# EAGLE design OpenCoffee V2 (DBL Test) (EAGLE 9.5.0)
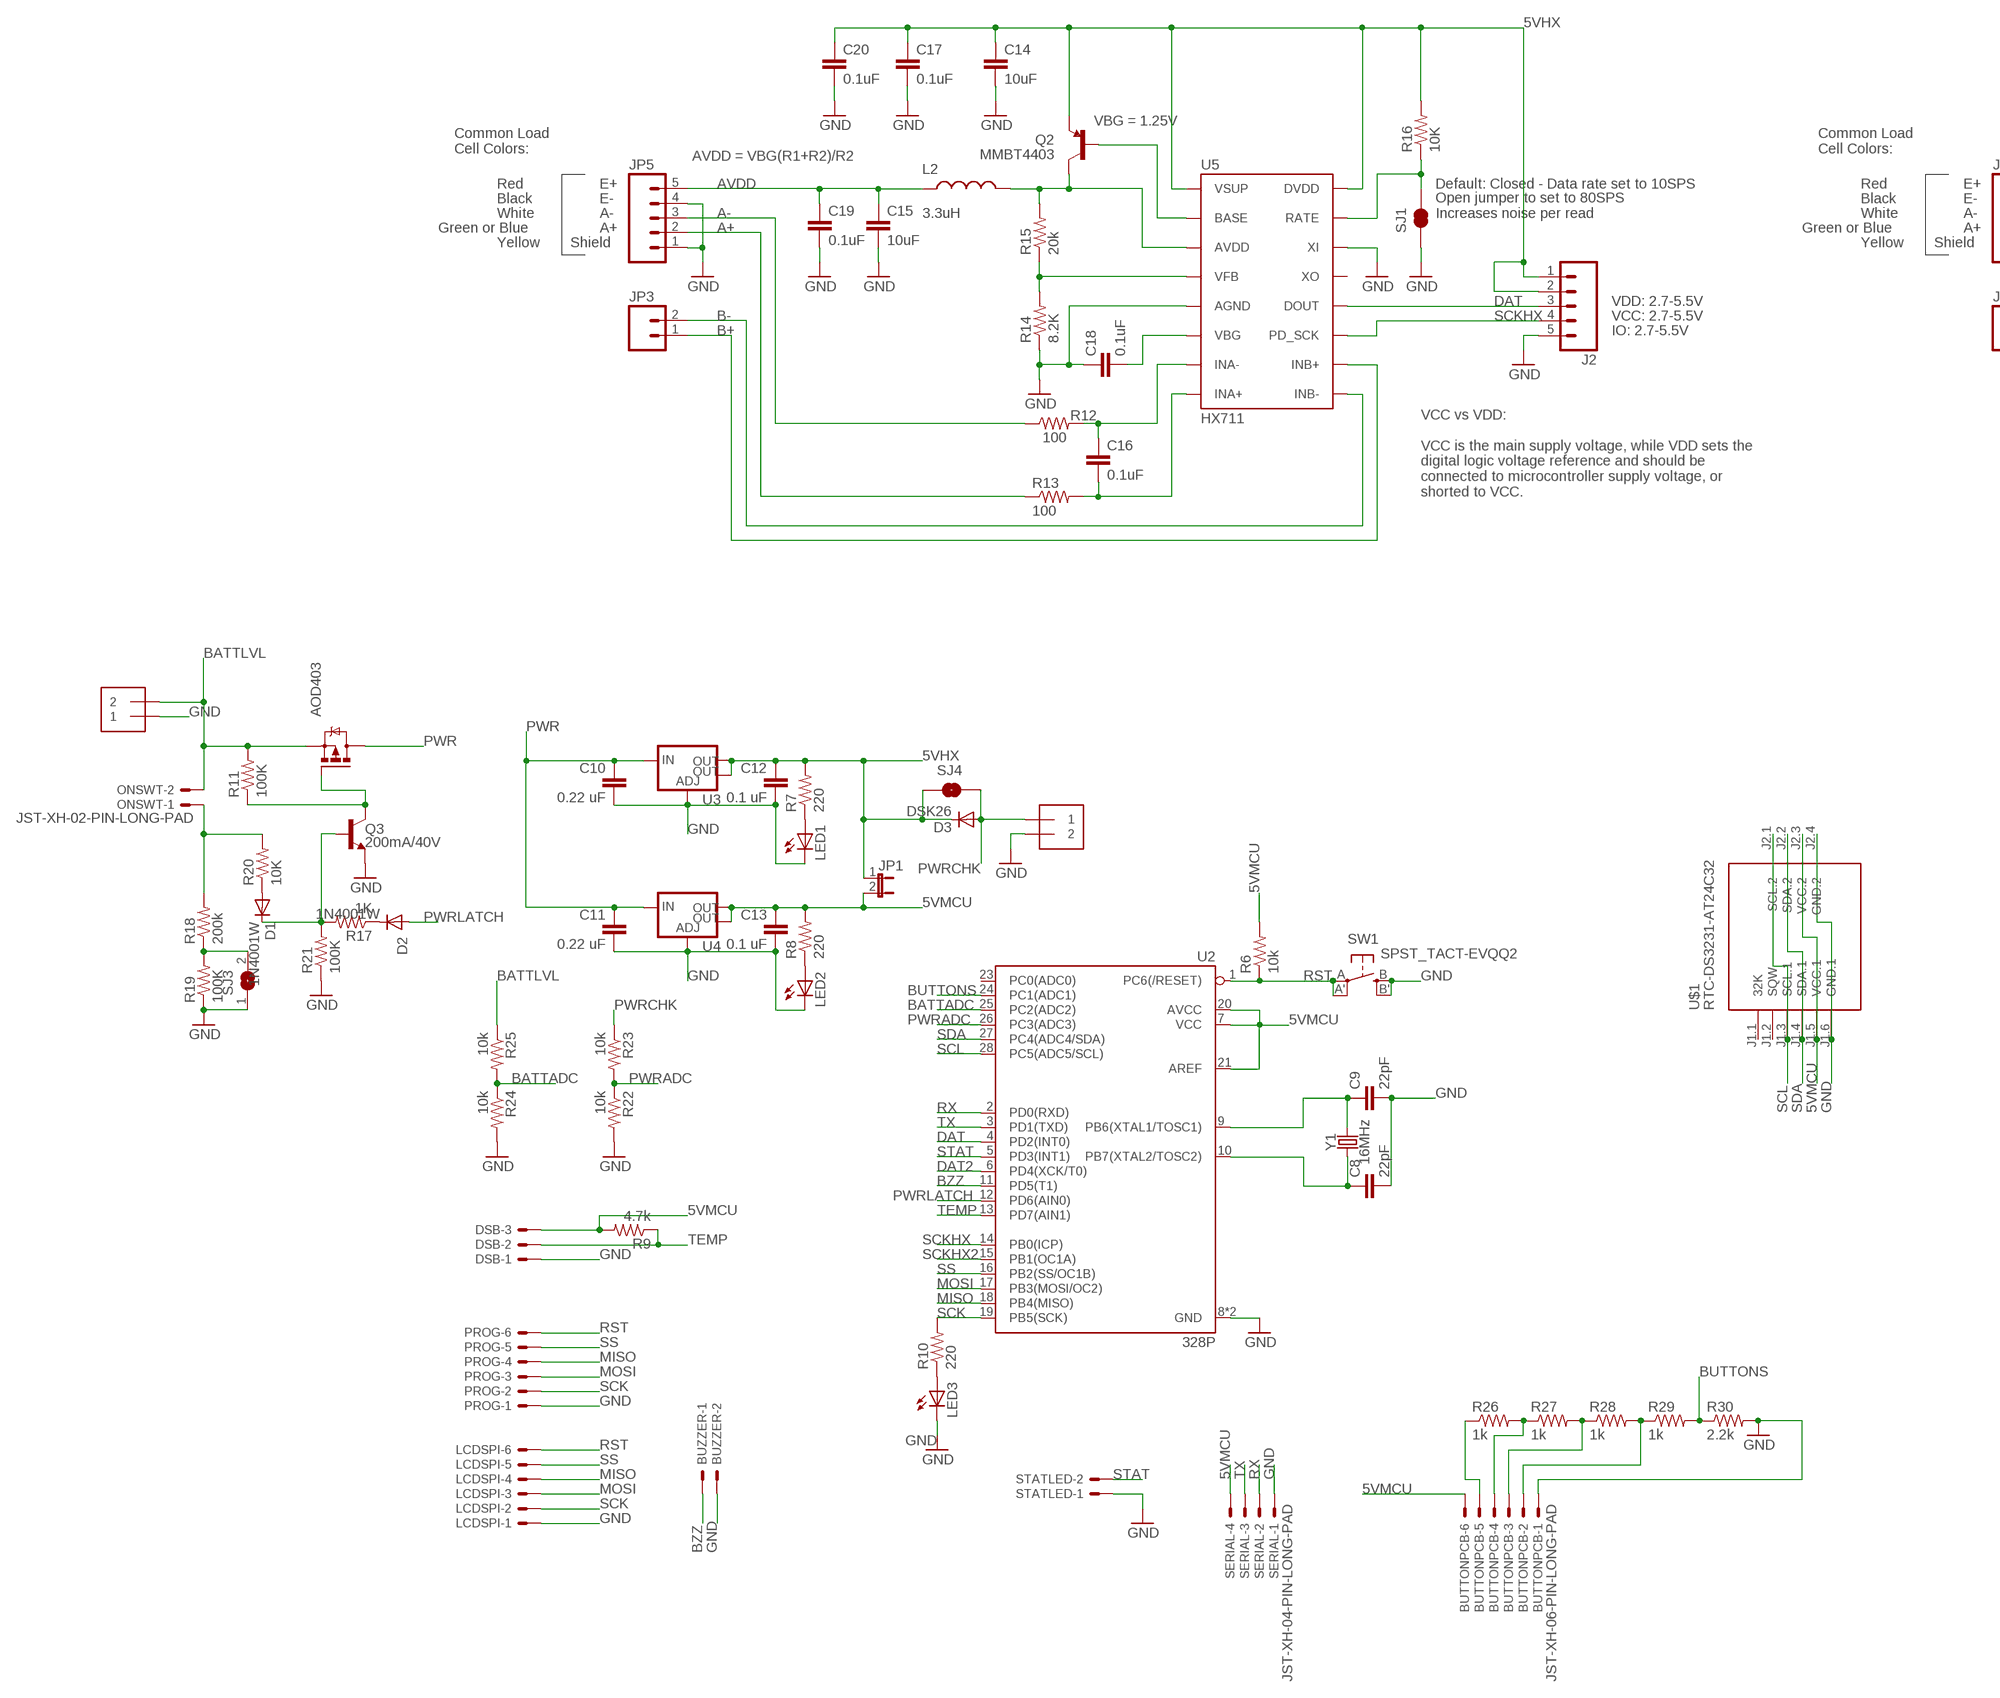
[diagram p0: schematic, sheet 1, part 1 of 2]
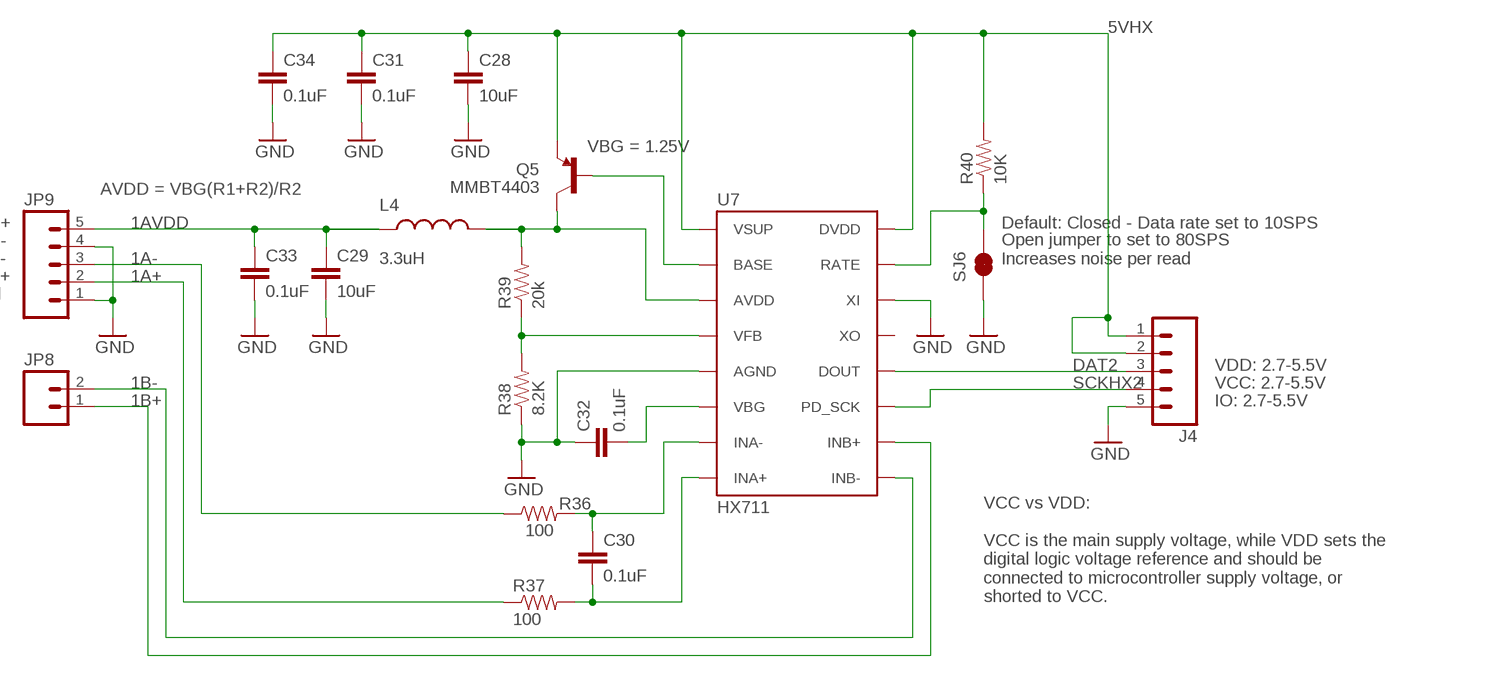
[diagram p1: schematic, sheet 1, part 2 of 2]

## Parts
AOD403  IRFR5305  [D-PAK_TO252AA]
BATT  1X2-3.5MM  [1X2-3.5MM]
BUTTONPCB  JST-XH-06-PIN-LONG-PAD  [JST-XH-06-PACKAGE-LONG-PAD]
BUZZER  JST-XH-02-PIN-LONG-PAD  [JST-XH-02-PACKAGE-LONG-PAD]
C8  22pF  C-EUC1206  [C1206]
C9  22pF  C-EUC1206  [C1206]
C10  0.22 uF  C-EUC1206  [C1206]
C11  0.22 uF  C-EUC1206  [C1206]
C12  0.1 uF  C-EUC1206  [C1206]
C13  0.1 uF  C-EUC1206  [C1206]
C14  10uF  10UF50V20%(1210)  [1210]
C15  10uF  10UF50V20%(1210)  [1210]
C16  0.1uF  0.1UF-25V-5%(0603)  [0603-CAP]
C17  0.1uF  0.1UF-25V-5%(0603)  [0603-CAP]
C18  0.1uF  0.1UF-25V-5%(0603)  [0603-CAP]
C19  0.1uF  0.1UF-25V-5%(0603)  [0603-CAP]
C20  0.1uF  0.1UF-25V-5%(0603)  [0603-CAP]
C28  10uF  10UF50V20%(1210)  [1210]
C29  10uF  10UF50V20%(1210)  [1210]
C30  0.1uF  0.1UF-25V-5%(0603)  [0603-CAP]
C31  0.1uF  0.1UF-25V-5%(0603)  [0603-CAP]
C32  0.1uF  0.1UF-25V-5%(0603)  [0603-CAP]
C33  0.1uF  0.1UF-25V-5%(0603)  [0603-CAP]
C34  0.1uF  0.1UF-25V-5%(0603)  [0603-CAP]
D1  1N4001W  DIODE-SOD123  [SOD123]
D2  1N4001W  DIODE-SOD123  [SOD123]
D3  DSK26  DIODE-SOD123  [SOD123]
DSB  JST-XH-03-PIN-LONG-PAD  [JST-XH-03-PACKAGE-LONG-PAD]
J2  M05PTH  [1X05]
J4  M05PTH  [1X05]
JP1  JP1E  [JP1]
JP3  M02PTH  [1X02]
JP5  M05PTH  [1X05]
JP8  M02PTH  [1X02]
JP9  M05PTH  [1X05]
L2  3.3uH  INDUCTOR0805-IND  [0805]
L4  3.3uH  INDUCTOR0805-IND  [0805]
LCDSPI  JST-XH-06-PIN-LONG-PAD  [JST-XH-06-PACKAGE-LONG-PAD]
LED1  LEDCHIPLED_1206  [CHIPLED_1206]
LED2  LEDCHIPLED_1206  [CHIPLED_1206]
LED3  LEDCHIPLED_1206  [CHIPLED_1206]
ONSWT  JST-XH-02-PIN-LONG-PAD  [JST-XH-02-PACKAGE-LONG-PAD]
PROG  JST-XH-06-PIN-LONG-PAD  [JST-XH-06-PACKAGE-LONG-PAD]
Q2  MMBT4403  TRANSISTOR_PNPMMBT4403  [SOT23-3]
Q3  200mA/40V  TRANS_NPN-2N3904  [TO-92@1]
Q5  MMBT4403  TRANSISTOR_PNPMMBT4403  [SOT23-3]
R6  10k  R-US_R1206  [R1206]
R7  220  R-US_R1206  [R1206]
R8  220  R-US_R1206  [R1206]
R9  4.7k  R-US_R1206  [R1206]
R10  220  R-US_R1206  [R1206]
R11  100K  R-US_R1206  [R1206]
R12  100  100OHM-1/10W-1%(0603)  [0603-RES]
R13  100  100OHM-1/10W-1%(0603)  [0603-RES]
R14  8.2K  8.2KOHM-1/10W-5%(0603)  [0603-RES]
R15  20k  20KOHM1/10W1%(0603)  [0603-RES]
R16  10K  10KOHM-1/10W-1%(0603)0603  [0603-RES]
R17  1K  R-US_R1206  [R1206]
R18  200k  R-US_R1206  [R1206]
R19  100K  R-US_R1206  [R1206]
R20  10K  R-US_R1206  [R1206]
R21  100K  R-US_R1206  [R1206]
R22  10k  R-US_R1206  [R1206]
R23  10k  R-US_R1206  [R1206]
R24  10k  R-US_R1206  [R1206]
R25  10k  R-US_R1206  [R1206]
R26  1k  R-US_R1206  [R1206]
R27  1k  R-US_R1206  [R1206]
R28  1k  R-US_R1206  [R1206]
R29  1k  R-US_R1206  [R1206]
R30  2.2k  R-US_R1206  [R1206]
R36  100  100OHM-1/10W-1%(0603)  [0603-RES]
R37  100  100OHM-1/10W-1%(0603)  [0603-RES]
R38  8.2K  8.2KOHM-1/10W-5%(0603)  [0603-RES]
R39  20k  20KOHM1/10W1%(0603)  [0603-RES]
R40  10K  10KOHM-1/10W-1%(0603)0603  [0603-RES]
SERIAL  JST-XH-04-PIN-LONG-PAD  [JST-XH-04-PACKAGE-LONG-PAD]
SJ1  JUMPER-PAD-2-NC_BY_TRACE  [PAD-JUMPER-2-NC_BY_TRACE_YES_SILK]
SJ3  SJ  [SJ]
SJ4  SOLDERJUMPERNO  [SJ_2S-NO]
SJ6  JUMPER-PAD-2-NC_BY_TRACE  [PAD-JUMPER-2-NC_BY_TRACE_YES_SILK]
STATLED  JST-XH-02-PIN-LONG-PAD  [JST-XH-02-PACKAGE-LONG-PAD]
SW1  SPST_TACT-EVQQ2  [EVQ-Q2]
U2  328P  ATMEGA328P_PDIP  [DIP28]
U3  V_REG_LM1117SOT223  [SOT223]
U4  V_REG_LM1117SOT223  [SOT223]
U5  HX711  HX711HX711  [SO16]
U7  HX711  HX711HX711  [SO16]
U$1  RTC-DS3231-AT24C32  [RTC-DS3231-AT24C32]
USBPWR  1X2-3.5MM  [1X2-3.5MM]
Y1  16MHz  CRYSTAL-16MHZPTH-HC49US  [HC49US]

## Nets
1A+: JP9.2 R37.1
1A-: JP9.3 R36.1
1AVDD: C29.1 C33.1 JP9.5 L4.1
1B+: JP8.1 U7.10(INB+)
1B-: JP8.2 U7.9(INB-)
5VHX: C12.1 C14.1 C17.1 C20.1 C28.1 C31.1 C34.1 D3.C J2.1 J2.2 J4.1 J4.2 JP1.1 Q2.2(E) Q5.2(E) R7.2 R16.2 R40.2 SJ4.1 U3.2(OUT) U3.4(OUT) U5.1(VSUP) U5.16(DVDD) U7.1(VSUP) U7.16(DVDD)
5VMCU: BUTTONPCB.6 C13.1 DSB.3 JP1.2 R6.2 R8.2 R9.2 SERIAL.4 U2.7(VCC) U2.20(AVCC) U2.21(AREF) U4.2(OUT) U4.4(OUT) U$1.J1.5(VCC.1) U$1.J2.3(VCC.2)
A+: JP5.2 R13.1
A-: JP5.3 R12.1
AVDD: C15.1 C19.1 JP5.5 L2.1
B+: JP3.1 U5.10(INB+)
B-: JP3.2 U5.9(INB-)
BATTADC: R24.1 R25.2 U2.25(PC2(ADC2))
BATTLVL: AOD403.3(S) BATT.2 ONSWT.2 R11.2 R25.1
BUTTONS: R29.2 R30.1 U2.24(PC1(ADC1))
BZZ: BUZZER.1 U2.11(PD5(T1))
DAT: J2.3 U2.4(PD2(INT0)) U5.12(DOUT)
DAT2: J4.3 U2.6(PD4(XCK/T0)) U7.12(DOUT)
GND: BATT.1 BUTTONPCB.1 BUZZER.2 C8.2 C9.2 C10.2 C11.2 C12.2 C13.2 C14.2 C15.2 C17.2 C18.1 C19.2 C20.2 C28.2 C29.2 C31.2 C32.1 C33.2 C34.2 DSB.1 J2.5 J4.5 JP5.1 JP5.4 JP9.1 JP9.4 LCDSPI.1 LED1.C LED2.C LED3.C PROG.1 Q3.1(E) R14.1 R19.1 R21.1 R22.2 R24.2 R30.2 R38.1 SERIAL.1 SJ1.1 SJ3.1 SJ6.1 STATLED.1 SW1.B'(S1) SW1.B(S) U2.8(GND) U2.22(GND) U3.1(ADJ) U4.1(ADJ) U5.5(AGND) U5.14(XI) U7.5(AGND) U7.14(XI) U$1.J1.6(GND.1) U$1.J2.4(GND.2) USBPWR.2
MISO: LCDSPI.4 PROG.4 U2.18(PB4(MISO))
MOSI: LCDSPI.3 PROG.3 U2.17(PB3(MOSI/OC2))
N$8: C9.1 U2.9(PB6(XTAL1/TOSC1)) Y1.2
N$9: C8.1 U2.10(PB7(XTAL2/TOSC2)) Y1.1
N$11: AOD403.1(G) Q3.3(C) R11.1
N$16: Q2.1(B) U5.2(BASE)
N$17: D2.C R17.1
N$18: LED1.A R7.1
N$19: LED2.A R8.1
N$20: R14.2 R15.1 U5.4(VFB)
N$21: LED3.A R10.1
N$23: C18.2 U5.6(VBG)
N$25: L2.2 Q2.3(C) R15.2 U5.3(AVDD)
N$26: R16.1 SJ1.2 U5.15(RATE)
N$27: C16.1 R12.2 U5.7(INA-)
N$28: C16.2 R13.2 U5.8(INA+)
N$29: R18.1 R19.2 SJ3.2
N$30: D1.A R20.1
N$31: D1.C Q3.2(B) R17.2 R21.2
N$33: BUTTONPCB.4 R26.2 R27.1
N$34: BUTTONPCB.3 R27.2 R28.1
N$35: BUTTONPCB.2 R28.2 R29.1
N$36: BUTTONPCB.5 R26.1
N$114: Q5.1(B) U7.2(BASE)
N$115: R38.2 R39.1 U7.4(VFB)
N$116: C32.2 U7.6(VBG)
N$117: L4.2 Q5.3(C) R39.2 U7.3(AVDD)
N$118: R40.1 SJ6.2 U7.15(RATE)
N$119: C30.1 R36.2 U7.7(INA-)
N$120: C30.2 R37.2 U7.8(INA+)
ONSWT: ONSWT.1 R18.2 R20.2
PWR: AOD403.4(D) C10.1 C11.1 U3.3(IN) U4.3(IN)
PWRADC: R22.1 R23.2 U2.26(PC3(ADC3))
PWRCHK: D3.A R23.1 SJ4.2 USBPWR.1
PWRLATCH: D2.A U2.12(PD6(AIN0))
RST: LCDSPI.6 PROG.6 R6.1 SW1.A'(P1) SW1.A(P) U2.1(PC6(/RESET))
RX: SERIAL.2 U2.2(PD0(RXD))
SCK: LCDSPI.2 PROG.2 R10.2 U2.19(PB5(SCK))
SCKHX: J2.4 U2.14(PB0(ICP)) U5.11(PD_SCK)
SCKHX2: J4.4 U2.15(PB1(OC1A)) U7.11(PD_SCK)
SCL: U2.28(PC5(ADC5/SCL)) U$1.J1.3(SCL.1) U$1.J2.1(SCL.2)
SDA: U2.27(PC4(ADC4/SDA)) U$1.J1.4(SDA.1) U$1.J2.2(SDA.2)
SS: LCDSPI.5 PROG.5 U2.16(PB2(SS/OC1B))
STAT: STATLED.2 U2.5(PD3(INT1))
TEMP: DSB.2 R9.1 U2.13(PD7(AIN1))
TX: SERIAL.3 U2.3(PD1(TXD))
Unconnected: U2.23(PC0(ADC0)) U5.13(XO) U7.13(XO) U$1.J1.1(32K) U$1.J1.2(SQW)

## Notes on the sheet
- VBG = 1.25V | VBG = 1.25V
- Common Load
  Cell Colors:
- Common Load
  Cell Colors:
- AVDD = VBG(R1+R2)/R2 | AVDD = VBG(R1+R2)/R2
- Red | E+ | Default: Closed - Data rate set to 10SPS | Red | E+ | Default: Closed - Data rate set to 10SPS
- Black | E- | Black | E-
- White | A-
- Open jumper to set to 80SPS
  Increases noise per read
- White | A-
- Open jumper to set to 80SPS
  Increases noise per read
- Green or Blue | A+ | Green or Blue | A+
- Yellow | Shield | Yellow | Shield
- VDD: 2.7-5.5V | VDD: 2.7-5.5V
- VCC: 2.7-5.5V | VCC: 2.7-5.5V
- IO: 2.7-5.5V | IO: 2.7-5.5V
- VCC vs VDD:
  
  VCC is the main supply voltage, while VDD sets the
  digital logic voltage reference and should be
  connected to microcontroller supply voltage, or
  shorted to VCC.
- VCC vs VDD:
  
  VCC is the main supply voltage, while VDD sets the
  digital logic voltage reference and should be
  connected to microcontroller supply voltage, or
  shorted to VCC.

## Library data of the parts
AOD403 = transistor-power:IRF?5305: HEXFET Power MOSFET Source: http://www.irf.com/product-info/datasheets/data/irfr5305pbf.pdf
BATT USBPWR = adafruit:1X2: 3.5mm Terminal block http://www.ladyada.net/library/pcb/eaglelibrary.html
BUTTONPCB LCDSPI PROG = Rembrandt Electronics - JST XH Connectors v1-0:JST-XH-06-PIN: JST XH Connector 2 Pin Wire to board connector. Pitch: 2,54 mm, (0.100") Number of pins: 6 Created by Rembrandt Electronics www.rembrandtelectronics.com
BUZZER ONSWT STATLED = Rembrandt Electronics - JST XH Connectors v1-0:JST-XH-02-PIN: JST XH Connector 2 Pin Wire to board connector. Pitch: 2,54 mm, (0.100") Number of pins: 2 Created by Rembrandt Electronics www.rembrandtelectronics.com
C8-C13 = custom:C-EU: CAPACITOR, European symbol; SPICEPREFIX: C
C14 C15 C28 C29 = SparkFun-Capacitors:10UF50V20%(1210): CAP-09824; PROD_ID: CAP-09824
C16-C20 C30-C34 = SparkFun-Capacitors:0.1UF-25V-5%(0603): CAP-08604; PROD_ID: CAP-08604
D1-D3 = diode:DIODE-: DIODE
DSB = Rembrandt Electronics - JST XH Connectors v1-0:JST-XH-03-PIN: JST XH Connector 2 Pin Wire to board connector. Pitch: 2,54 mm, (0.100") Number of pins: 3 Created by Rembrandt Electronics www.rembrandtelectronics.com
J2 J4 JP5 JP9 = SparkFun-Connectors:M05: Header 5 Standard 5-pin 0.1" header. Use with straight break away headers (SKU : PRT-00116), right angle break away headers (PRT-00553), swiss pins (PRT-00743), machine pins (PRT-00117), and female headers (PRT-00115). Molex polarized connector foot print use with SKU : PRT-08230 with associated crimp pins and housings.
JP1 = jumper:JP1E: JUMPER
JP3 JP8 = SparkFun-Connectors:M02: Standard 2-pin 0.1" header. Use with - straight break away headers ( PRT-00116) - right angle break away headers (PRT-00553) - swiss pins (PRT-00743) - machine pins (PRT-00117) - female headers (PRT-00115) Molex polarized connector foot print use with: PRT-08233 with associated crimp pins and housings. 2.54_SCREWTERM for use with PRT-10571. 3.5mm Screw Terminal footprints for PRT-08084 5mm Screw Terminal footprints for use with PRT-08432
L2 L4 = SparkFun-Passives:INDUCTOR: Inductors Basic Inductor/Choke - 0603 and 1206. Footprints are not proven and vary greatly between part numbers. INDUCTOR POWER 3.3UH 4.0A SMD 0.197" L x 0.197" W x 0.177" H (5.00mm x 5.00mm x 4.50mm); PROD_ID: NDUC-13076
LED1-LED3 = adafruit:LED: LED OSRAM: - CHIPLED LG R971, LG N971, LY N971, LG Q971, LY Q971, LO R971, LY R971 LH N974, LH R974 LS Q976, LO Q976, LY Q976 LO Q996 - Hyper CHIPLED LW Q18S LB Q993, LB Q99A, LB R99A - SideLED LS A670, LO A670, LY A670, LG A670, LP A670 LB A673, LV A673, LT A673, LW A673 LH A674 LY A675 LS A676, LA A676, LO A676, LY A676, LW A676 LS A679, LY A679, LG A679 - Hyper Micro SIDELED® LS Y876, LA Y876, LO Y876, LY Y876 LT Y87S - SmartLED LW L88C, LW L88S LB L89C, LB L89S, LG L890 LS L89K, LO L89K, LY L89K LS L896, LA L896, LO L896, LY L896 - TOPLED LS T670, LO T670, LY T670, LG T670, LP T670 LSG T670, LSP T670, LSY T670, LOP T670, LYG T670 LG T671, LOG T671, LSG T671 LB T673, LV T673, LT T673, LW T673 LH T674 LS T676, LA T676, LO T676, LY T676, LB T676, LH T676, LSB T676, LW T676 LB T67C, LV T67C, LT T67C, LS T67K, LO T67K, LY T67K, LW E67C LS E67B, LA E67B, LO E67B, LY E67B, LB E67C, LV E67C, LT E67C LW T67C LS T679, LY T679, LG T679 LS T770, LO T770, LY T770, LG T770, LP T770 LB T773, LV T773, LT T773, LW T773 LH T774 LS E675, LA E675, LY E675, LS T675 LS T776, LA T776, LO T776, LY T776, LB T776 LHGB T686 LT T68C, LB T68C - Hyper Mini TOPLED® LB M676 - Mini TOPLED Santana® LG M470 LS M47K, LO M47K, LY M47K Source: http://www.osram.convergy.de/
Q2 Q5 = SparkFun-DiscreteSemi:TRANSISTOR_PNP: Generic PNP BJT Double check pinouts against datasheets- not all devices are the same! MMBT3906 - 40V 200mA SOT-23 (TRANS-08052) MMBT4403 - 40V 600mA SOT-23 (TRANS-09245); PROD_ID: TRANS-09245
Q3 = SparkFun-DiscreteSemi:TRANS_NPN: NPN transistor Current controlled devices typically used to amplify current or used as a switch. BC547 - COM-08928 <http://www.sparkfun.com/products/8928> (TO-92 45V 100mA) (1.Collector 2.Base 3.Emitter) 2N3904 - COM-00521 <http://www.sparkfun.com/products/521> (TO-92 40V 200mA) (1.Emitter 2.Base 3.Collector) P2N2222A - COM-12852 <http://www.sparkfun.com/products/12852> (TO-92 40V 600mA) (1.Collector 2.Base 3.Emitter); PROD_ID: TRANS-08447
R6-R11 R17-R30 = adafruit:R-US_: RESISTOR, American symbol
R12 R13 R36 R37 = SparkFun-Resistors:100OHM-1/10W-1%(0603): RES-07863; PROD_ID: RES-07863
R14 R38 = SparkFun-Resistors:8.2KOHM-1/10W-5%(0603): RES-10646; PROD_ID: RES-10646
R15 R39 = SparkFun-Resistors:20KOHM1/10W1%(0603): RES-09383; PROD_ID: RES-09383
R16 R40 = SparkFun-Resistors:10KOHM-1/10W-1%(0603): RES-00824; PROD_ID: RES-00824
SERIAL = Rembrandt Electronics - JST XH Connectors v1-0:JST-XH-04-PIN: JST XH Connector 2 Pin Wire to board connector. Pitch: 2,54 mm, (0.100") Number of pins: 4 Created by Rembrandt Electronics www.rembrandtelectronics.com
SJ1 SJ6 = SparkFun-Passives:JUMPER-PAD-2-NC_BY_TRACE
SJ3 = jumper:SJ: SMD solder JUMPER
SJ4 = SparkFun:SOLDERJUMPER: Solder Jumper Standard SMD solder jumper. Used to automate production. Two varients : Normally Open and Normally Closed are the same, but have different paste layers. NC will have a large amount of paste and should jumper during reflow.
SW1 = adafruit:SPST_TACT: SMT 6mm switch, EVQQ2 series http://www.ladyada.net/library/eagle
U2 = SparkFun-IC-Microcontroller:ATMEGA328P_PDIP: Atmel 328P Through hole ATMEGA328P uC used in the Arduino 32kb flash, 1k EEPROM, 2k SRAM Datasheet <http://www.sparkfun.com/datasheets/Components/SMD/ATMega328.pdf> SparkFun Products Storefront component: AVR 28 Pin 20MHz 32K 6A/D - ATMega328P <https://www.sparkfun.com/products/9061> (COM-09061) SparkFun Simon Says - Through-Hole Soldering Kit <https://www.sparkfun.com/products/10547> (KIT-10547) SparkFun Learn to Solder - Simon Says <https://www.sparkfun.com/products/13708> (KIT-13708) SparkFun BigTime Watch Kit <https://www.sparkfun.com/products/11734> (KIT-11734) SparkFun ClockIt <https://www.sparkfun.com/products/10930> (KIT-10930) SparkFun Serial Enabled LCD Kit <https://www.sparkfun.com/products/10097> (LCD-10097) SparkFun Simon Tilts - Through Hole Soldering Kit <https://www.sparkfun.com/products/12634> (KIT-12634) SparkFun Frequency Counter Kit <https://www.sparkfun.com/products/10140> (KIT-10140) FabFM Radio Kit <https://www.sparkfun.com/products/11043> (KIT-11043) SparkFun Binary Blaster Kit <https://www.sparkfun.com/products/12037> (KIT-12037) SparkFun Metro-Gnome <https://www.sparkfun.com/products/9236> (KIT-09236) ATmega328 with Arduino Optiboot (Uno) <https://www.sparkfun.com/products/10524> (DEV-10524); PROD_ID: IC-09136
U3 U4 = SparkFun-IC-Power:V_REG_LM1117: Voltage Regulator LM1117 Standard adjustable voltage regulator but in SMD form. Spark Fun Electronics SKU : COM-00595; PROD_ID: VREG-08170
U5 U7 = Testing:HX711; PROD_ID: IC-12445
U$1 = diy-modules:RTC-DS3231-AT24C32: RTC Module with Battery and EEPROM based on DS3231 and AT24C32 chips Tutorial can be found here: https://edwardmallon.wordpress.com/2014/05/21/using-a-cheap-3-ds3231-rtc-at24c32-eeprom-from-ebay/ Click here to find device on ebay.com <http://www.ebay.com/sch/DS3231+AT24C32+module>
Y1 = SparkFun-Clocks:CRYSTAL-16MHZ: 16MHz Crystal Digikey Example <http://www.digikey.com/product-search/en?keywords=535-9122-1-ND> Frequency: 16MHz Frequency Stability: ±50ppm Frequency Tolerance: ±20ppm Load Capacitance: 18pF SparkFun Products: Pro Micro -5V/16MHz <https://www.sparkfun.com/products/12640> SparkFun Serial Enabled LCD Kit <https://www.sparkfun.com/products/10097>; PROD_ID: XTAL-08181; SF_ID: COM-00536

## Board
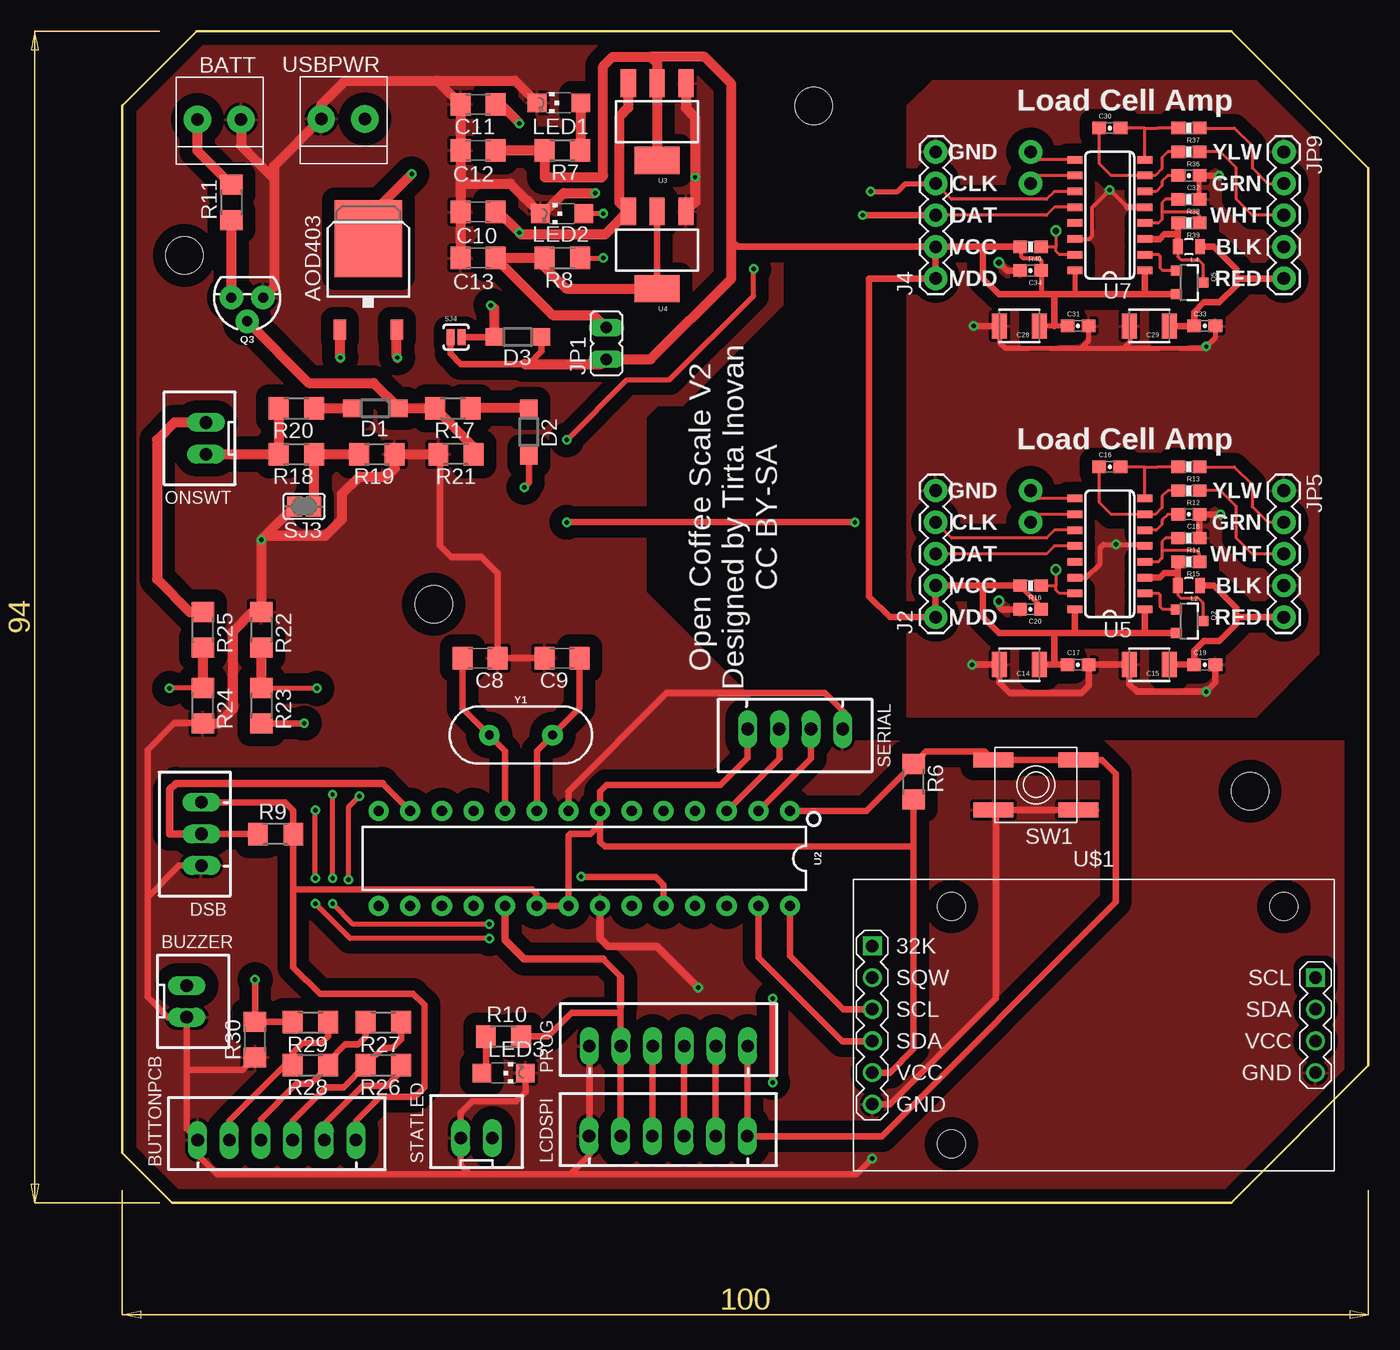
[diagram p2: board, top side]
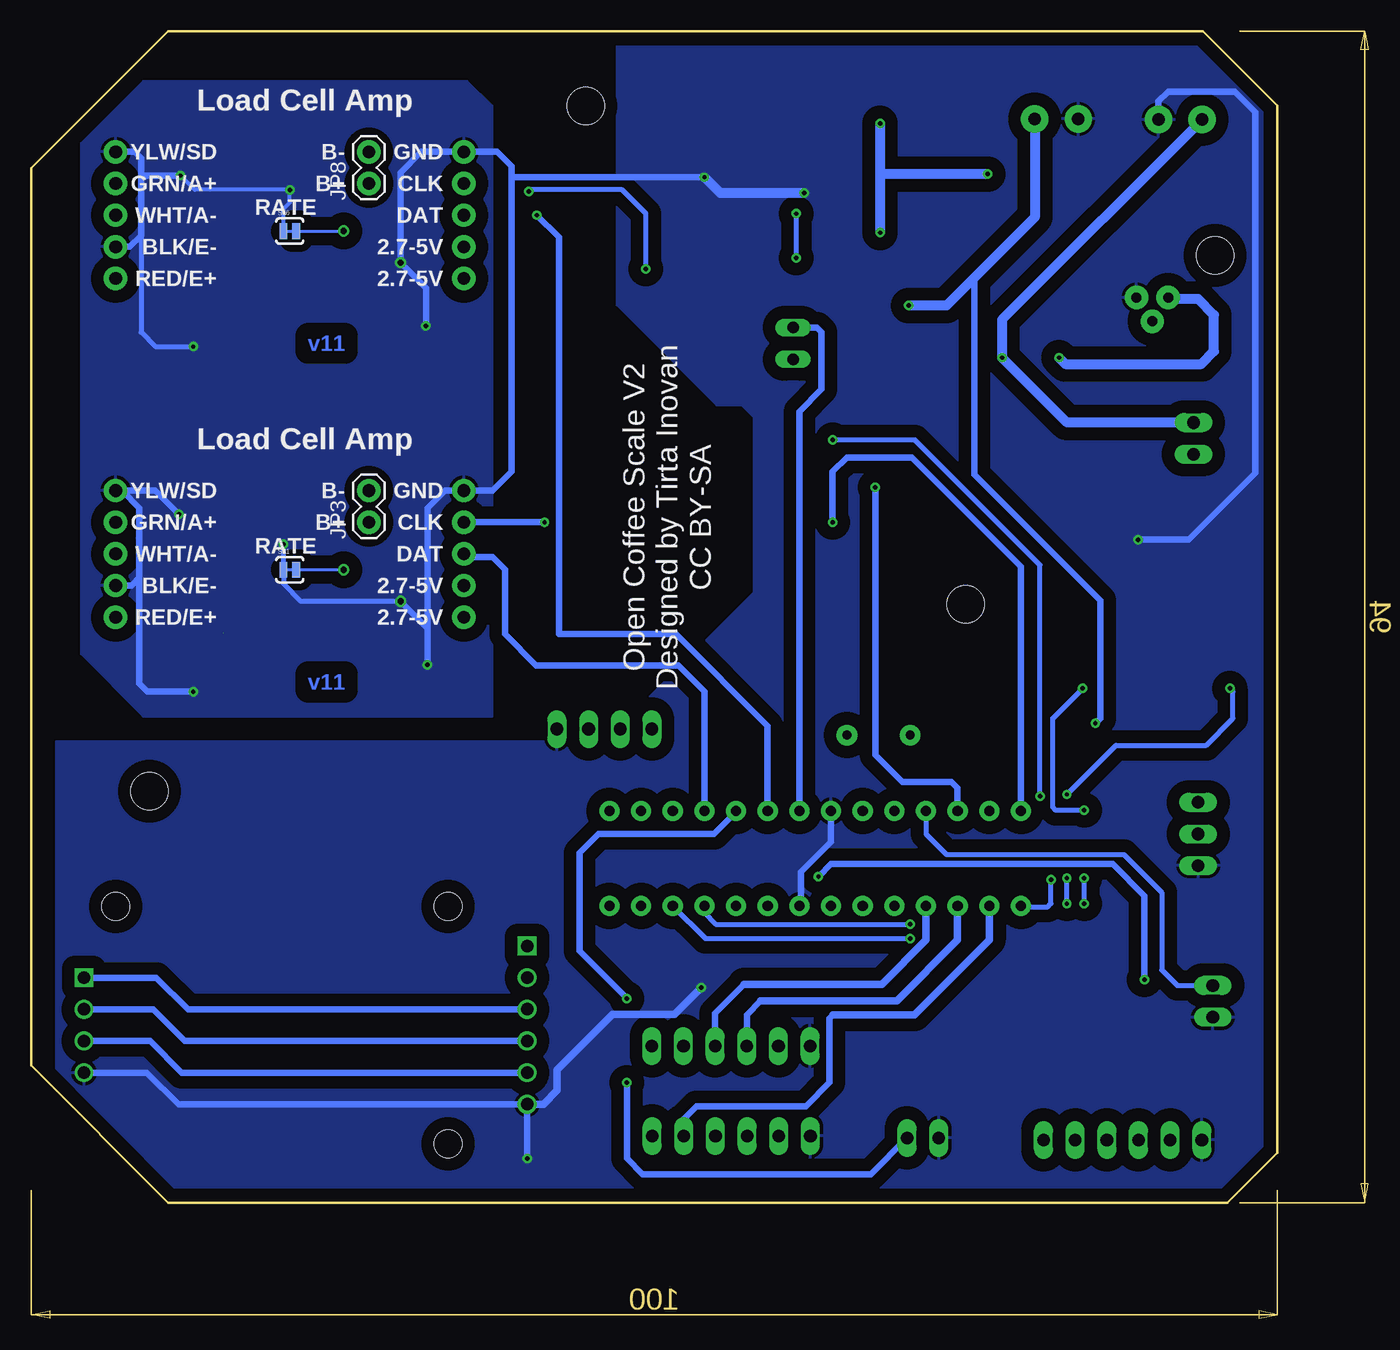
[diagram p3: board, bottom side, seen from below]

Size 100 x 94 mm. Coordinates in mm from the lower left corner, seen from the top.
Outline: 89,0 100,11 100,83 89,94 6,94 0,88 0,4 4,0 89,0
Copper layers (1*16): Top 0.035mm / dielectric 1.5mm / Bottom 0.035mm
Design rules "default": minimum track width 6mil, minimum drill 0.35mm, track to track 6mil, track to pad 6mil, pad to pad 6mil, via to via 6mil, smd to smd 6mil, copper to edge 40mil, drill to drill 6mil, minimum pad ring 10mil, minimum via ring 8mil, stop-mask expansion 4mil, vias tented up to drill 0mil, thermal gap 10mil
Holes 3 mm at 5,76 55.5,88 90.5,33 25,48

### Footprints (pad centres in the part's own frame; a part is rotated, then mirrored left to right if it is on the bottom)
D-PAK_TO252AA = smd 1 x 1.6: 1 -2.28,-4.8; 3 2.28,-4.8 | smd 5.4 x 6.2: 4 0,2.5
1X2-3.5MM = drill 1 pad 2.184: 1 1.8,0; 2 -1.7,0
JST-XH-06-PACKAGE-LONG-PAD = drill 1.016 long: 1 -6.35,0; 2 -3.81,0; 3 -1.27,0; 4 1.27,0; 5 3.81,0; 6 6.35,0
JST-XH-02-PACKAGE-LONG-PAD = drill 1.016 long: 1 -1.27,0; 2 1.27,0
C1206 = smd 1.6 x 1.8: 1 -1.4,0; 2 1.4,0
1210 = smd 1.2 x 2: 1 -1.6,0; 2 1.6,0
0603-CAP = smd 1.1 x 1: 1 -0.85,0; 2 0.85,0
SOD123 = smd 1.4 x 1.4: A 1.9,0; C -1.9,0
JST-XH-03-PACKAGE-LONG-PAD = drill 1.016 long: 1 -2.54,0; 2 0,0; 3 2.54,0
1X05 = drill 1.016 pad 1.88: 1 0,0; 2 2.54,0; 3 5.08,0; 4 7.62,0; 5 10.16,0
JP1 = drill 0.914 long: 1 0,-1.27; 2 0,1.27
1X02 = drill 1.016 pad 1.88: 1 0,0; 2 2.54,0
0805 = smd 0.8 x 1.2: 1 -0.9,0; 2 0.9,0
CHIPLED_1206 = smd 1.5 x 1.5: A 0,-1.75; C 0,1.75
SOT23-3 = smd 0.8 x 0.9: 1 -0.95,-1; 2 0.95,-1; 3 0,1.1
TO-92@1 = drill 0.813 pad 1.88: 1 -1.27,0; 2 0,1.905; 3 1.27,0
R1206 = smd 1.6 x 1.803: 1 -1.422,0; 2 1.422,0
0603-RES = smd 1.1 x 1: 1 -0.85,0; 2 0.85,0
JST-XH-04-PACKAGE-LONG-PAD = drill 1.016 long: 1 -3.81,0; 2 -1.27,0; 3 1.27,0; 4 3.81,0
PAD-JUMPER-2-NC_BY_TRACE_YES_SILK = smd 0.635 x 1.27: 1 -0.508,0; 2 0.508,0
SJ = smd 1.168 x 1.6: 1 -0.762,0; 2 0.762,0
SJ_2S-NO = smd 0.635 x 1.27: 1 -0.45,0; 2 0.45,0
EVQ-Q2 = smd 3.2 x 1.2: A -3.4,-2; A' 3.4,-2; B -3.4,2; B' 3.4,2
DIP28 = drill 0.813 pad 1.626: 1 -16.51,-3.81; 2 -13.97,-3.81; 3 -11.43,-3.81; 4 -8.89,-3.81; 5 -6.35,-3.81; 6 -3.81,-3.81; 7 -1.27,-3.81; 8 1.27,-3.81; 9 3.81,-3.81; 10 6.35,-3.81; 11 8.89,-3.81; 12 11.43,-3.81; 13 13.97,-3.81; 14 16.51,-3.81; 15 16.51,3.81; 16 13.97,3.81; 17 11.43,3.81; 18 8.89,3.81; 19 6.35,3.81; 20 3.81,3.81; 21 1.27,3.81; 22 -1.27,3.81; 23 -3.81,3.81; 24 -6.35,3.81; 25 -8.89,3.81; 26 -11.43,3.81; 27 -13.97,3.81; 28 -16.51,3.81
SOT223 = smd 1.219 x 2.235: 1 -2.311,-3.099; 2 0,-3.099; 3 2.311,-3.099 | smd 3.6 x 2.2: 4 0,3.099
SO16 = smd 0.6 x 1.2: 1 -4.445,-2.8; 2 -3.175,-2.8; 3 -1.905,-2.8; 4 -0.635,-2.8; 5 0.635,-2.8; 6 1.905,-2.8; 7 3.175,-2.8; 8 4.445,-2.8; 9 4.445,2.8; 10 3.175,2.8; 11 1.905,2.8; 12 0.635,2.8; 13 -0.635,2.8; 14 -1.905,2.8; 15 -3.175,2.8; 16 -4.445,2.8
RTC-DS3231-AT24C32 = drill 1 square: J1.1 -17.78,6.35; J2.1 17.78,3.81 | drill 1: J1.2 -17.78,3.81; J1.3 -17.78,1.27; J1.4 -17.78,-1.27; J1.5 -17.78,-3.81; J1.6 -17.78,-6.35; J2.2 17.78,1.27; J2.3 17.78,-1.27; J2.4 17.78,-3.81 | hole 2.2: -11.43,-9.525; -11.43,9.525; 15.24,9.525
HC49US = drill 0.7 pad 1.651: 1 -2.54,0; 2 2.54,0

### Placement (x,y rotation side)
AOD403  19.75,74.85 0 top
BATT  7.74,86.91 0 top
BUTTONPCB  12.41,5.02 0 top
BUZZER  5.18,16.15 270 top
C8  28.71,43.69 0 top
C9  35.3,43.69 180 top
C10  28.57,79.49 180 top
C11  28.57,88.12 180 top
C12  28.57,84.44 180 top
C13  28.57,75.8 180 top
C14  72.01,43.16 180 top
C15  82.42,43.16 180 top
C16  79.25,59.04 0 top
C17  76.71,43.16 0 top
C18  85.6,55.23 180 top
C19  86.87,43.16 0 top
C20  72.9,47.61 180 top
C28  72.01,70.34 180 top
C29  82.42,70.34 180 top
C30  79.25,86.22 0 top
C31  76.71,70.34 0 top
C32  85.6,82.41 180 top
C33  86.87,70.34 0 top
C34  72.9,74.79 180 top
D1  20.32,63.74 180 top
D2  32.64,61.83 270 top
D3  31.75,69.45 180 top
DSB  6.35,29.57 90 top
J2  65.28,46.97 90 top
J4  65.28,74.15 90 top
JP1  38.86,68.94 0 top
JP3  72.9,54.59 90 bottom
JP5  93.22,57.13 270 top
JP8  72.9,81.77 90 bottom
JP9  93.22,84.31 270 top
L2  85.6,49.51 180 top
L4  85.6,76.69 180 top
LCDSPI  43.82,5.34 0 top
LED1  35.05,88.25 90 top
LED2  35.31,79.36 90 top
LED3  30.61,10.4 270 top
ONSWT  6.73,61.33 90 top
PROG  43.84,12.56 0 top
Q2  85.6,46.66 270 top
Q3  10.03,72.63 180 top
Q5  85.6,73.83 270 top
R6  63.5,33.77 270 top
R7  35.31,84.44 180 top
R8  35.31,75.8 180 top
R9  12.32,29.57 0 top
R10  30.61,13.32 0 top
R11  8.76,80.25 90 top
R12  85.6,57.13 180 top
R13  85.6,59.04 180 top
R14  85.6,53.32 180 top
R15  85.6,51.42 180 top
R16  72.9,49.51 180 top
R17  26.54,63.74 180 top
R18  13.97,60.05 180 top
R19  20.45,60.05 180 top
R20  13.97,63.74 180 top
R21  26.8,60.05 0 top
R22  11.18,45.96 90 top
R23  11.18,39.86 90 top
R24  6.48,39.86 270 top
R25  6.48,45.96 270 top
R26  20.95,11.03 180 top
R27  20.95,14.46 180 top
R28  15.11,11.03 180 top
R29  15.11,14.46 180 top
R30  10.67,13.06 270 top
R36  85.6,84.31 180 top
R37  85.6,86.22 180 top
R38  85.6,80.5 180 top
R39  85.6,78.6 180 top
R40  72.9,76.69 180 top
SERIAL  54,38 180 top
SJ1  79.25,50.78 0 bottom
SJ3  14.61,55.86 0 top
SJ4  26.8,69.45 0 top
SJ6  79.25,77.96 0 bottom
STATLED  28.44,5.18 0 top
SW1  73.33,33.52 180 top
U2  37.09,27.61 180 top
U3  42.93,86.72 180 top
U4  42.93,76.44 180 top
U5  79.25,52.05 90 top
U7  79.25,79.23 90 top
U$1  77.98,14.24 0 top
USBPWR  17.67,86.96 0 top
Y1  32,37.52 0 top

### Tracks (layer width: path | path; a pad name or v marks a point on that pad's centre or on a via)
1A+
  Top 0.254: R37.1 89.26,86.22 90.68,84.8 90.68,83.03 91.94,81.77 JP9.2
1A-
  Top 0.254: JP9.3 90.68,79.23 89.41,80.5 89.41,83.04 88.14,84.31 R36.1
1AVDD
  Top 0.508: L4.1 87.61,76.69 89.41,74.9 89.41,74.15 | 89.41,74.15 JP9.5 | C29.1 C33.1 86.02,71.46 86.8,72.25 88.06,72.25 89.41,73.6 89.41,74.15
1B+
  Top 0.254: U7.10 73.53,82.41 JP8.1
1B-
  Top 0.254: U7.9 73.53,83.68 JP8.2
5VHX  (1 unrouted)
  Top 0.305: R40.2 72.14,76.6 72.14,75.93 72.26,75.8 73.53,75.8 73.75,75.59 C34.1
  Top 0.406: R16.2 73.75,47.81 C20.1 | C34.1 73.75,72.97 73.66,72.88 | U7.16 76.45,72.89 | C31.1 74.8,70.34 C28.1
  Top 0.508: SJ4.1 26.35,68.12 27.18,67.29 32.26,67.29 32.64,67.29 33.65,68.31 D3.C | 76.45,72.88 82.05,72.88 | 76.45,72.89 76.45,72.88 | 74.8,72.88 73.66,72.88 70.36,72.88 69.09,74.15 69.09,76.69 | U7.1 82.05,72.88 | 76.45,72.88 74.8,72.88 | 74.8,72.88 74.8,70.34 | 76.45,45.7 82.04,45.7 | 82.04,45.7 Q2.2 | 74.8,45.7 70.36,45.7 69.09,46.97 69.09,49.51 | R16.2 69.09,49.51 | 76.45,45.7 74.8,45.7 | 74.8,45.7 74.8,43.16 | J4.2 J4.1 59.94,74.15 59.94,48.62 61.59,46.97 J2.1 J2.2 69.09,49.51 | 69.09,76.69 J4.2 | 69.09,76.69 R40.2 | 74.8,43.16 C14.1 | 74.8,43.16 C17.1 | U5.1 82.05,45.71 82.04,45.7 | U5.16 76.45,45.71 76.45,45.7 | J4.2 49.4,76.69 48.9,77.2 | 82.05,72.88 Q5.2
  Top 0.813: U3.4 U3.2 42.93,91.42 42.42,91.93 | C12.1 R7.2 33.91,84.41 33.91,82.28 38.48,82.28 38.61,82.41 38.61,91.17 39.37,91.93 42.42,91.93 | 32.26,67.29 38.48,67.29 JP1.1 42.42,67.67 48.9,74.15 48.9,77.2 48.9,89.77 46.74,91.93 42.42,91.93
5VMCU
  Top 0.508: U2.7 38.36,28.94 38.74,28.56 63.5,28.56 | U$1.J1.5 61.59,10.43 63.5,12.34 63.5,28.56 | 63.5,28.56 R6.2 | DSB.3 13.08,32.11 13.74,31.45 R9.2 | R9.2 13.74,25.13 32.89,25.13 33.27,24.75 U2.20 U2.21 35.82,26.4 35.81,26.4 35.81,29.45 35.94,29.57 37.59,29.57 38.36,30.34 U2.7 | BUTTONPCB.6 18.76,6.55 20.7,8.49 23.5,8.49 24.26,9.26 24.26,15.86 23.37,16.75 15.88,16.75 13.74,18.88 R9.2 | U4.2 U4.4 | U2.7 38.36,33.01 38.86,33.51 48.01,33.51 50.19,35.7 SERIAL.4
  Top 0.813: U4.4 35.61,73.34 33.88,75.07 R8.2 C13.1 34.55,71.23 37.85,71.23 JP1.2
  Bottom 0.508: JP1.2 36.96,70.22 36.58,69.83 36.58,65.26 38.36,63.48 U2.7 | U$1.J1.5 87.92,10.43 90.46,12.97 U$1.J2.3
A+
  Top 0.254: R13.1 89.26,59.04 90.68,57.62 90.68,55.85 91.94,54.59 JP5.2
A-
  Top 0.254: JP5.3 90.68,52.05 89.41,53.32 89.41,55.86 88.14,57.13 R12.1
AVDD
  Top 0.508: L2.1 87.61,49.51 89.41,47.72 89.41,46.97 | 89.41,46.97 JP5.5 | C15.1 C19.1 86.02,44.29 86.8,45.07 88.06,45.07 89.41,46.42 89.41,46.97
B+
  Top 0.254: U5.10 73.53,55.23 JP3.1
B-
  Top 0.254: U5.9 73.53,56.5 JP3.2
BATTADC  (via drill 0.35)
  Top 0.406: v29.46,22.34 18.54,22.34 v16.89,23.99 | v16.89,26.02 v16.89,32.75 | R24.1 3.83,41.28 v3.81,41.26
  Top 0.813: R25.2 R24.1
  Bottom 0.406: U2.25 45.98,23.23 45.09,22.34 v29.46,22.34 | v16.89,23.99 v16.89,26.02 | v16.89,32.75 12.95,36.69 5.71,36.69 3.56,38.85 3.56,41.01 v3.81,41.26
BATTLVL  (via drill 0.35)
  Top 0.813: BATT.2 6.04,84.4 R11.2 | v22.1,67.8 22.03,67.87 AOD403.3 | ONSWT.2 4.19,62.59 2.79,61.2 2.79,50.02 5.44,47.38 R25.1
  Bottom 0.813: BATT.2 22.1,70.85 v22.1,67.8 16.89,62.59 ONSWT.2
BUTTONS  (via drill 0.35)
  Top 0.508: R29.2 13.67,14.49 R30.1 v10.67,17.89 | U2.24 43.44,25.51 42.8,26.15 v36.83,26.15
  Bottom 0.508: v36.83,26.15 35.81,27.16 13.21,27.16 10.67,24.62 v10.67,17.89
BZZ
  Bottom 0.406: U2.11 28.2,29.58 26.54,27.92 12.32,27.92 9.27,24.88 9.27,18.65 8.04,17.42 BUZZER.1
DAT
  Top 0.254: U5.12 74.8,52.69 74.17,52.05 J2.3
  Bottom 0.508: U2.4 45.98,41.01 48.07,43.1 59.47,43.1 61.98,45.61 61.98,50.78 62.99,51.8 65.02,51.8 J2.3
DAT2  (via drill 0.35)
  Top 0.254: U7.12 74.8,79.87 74.17,79.23 65.53,79.23 J4.3
  Top 0.508: v59.44,79.23 65.53,79.23
  Bottom 0.508: U2.6 40.9,38.26 48.26,45.62 57.66,45.62 57.66,77.45 v59.44,79.23
GND  (via drill 0.35, 0.51)
  Top 0.305: C34.2 72.14,74.7 | U7.14 77.6,77.33 77.85,77.58 77.85,79.87 v79.25,81.26 80.64,79.87
  Top 0.406: U5.5 81.92,52.82 v79.76,52.82 78.74,52.82 78.49,52.56 78.49,51.29 77.34,50.15 U5.14 | R38.1 C32.1 | C28.2 70.41,69.02 70.87,68.56 76.96,68.56 | 76.96,68.56 77.56,69.16 C31.2 | 76.96,68.56 80.39,68.56 | 80.39,68.56 80.9,69.07 80.9,70.27 C29.2 | 80.39,68.56 86.87,68.56 v87,68.69 87.76,69.45 87.76,70.3 C33.2
  Top 0.508: U$1.J1.6 61.59,7.89 70.1,16.4 70.1,31.34 SW1.B' SW1.B | PROG.1 37.49,5.36 | 37.49,5.36 LCDSPI.1 | 27.94,2.27 27.17,3.04 STATLED.1 27.17,7.21 28.07,8.11 31.62,8.11 32.36,8.85 LED3.C | 27.94,2.27 35.94,2.27 | 35.94,2.27 37.49,3.82 37.49,5.36 | 27.94,2.27 7.62,2.27 6.06,3.83 BUTTONPCB.1 5.18,5.9 5.18,10.65 | 5.18,10.65 BUZZER.2 3.65,14.88 2.03,16.49 2.03,24.5 | DSB.1 4.57,27.04 2.03,24.5 | R21.1 25.53,59.9 25.53,52.69 26.42,51.8 28.83,51.8 30.11,50.52 C8.2 C9.2 | R30.2 9.68,10.65 5.18,10.65 | 35.94,2.27 58.93,2.27 v60.2,3.54 | v88.14,55.23 C18.1 R14.1 | C19.2 87.72,41.73 v87,41.01 81.41,41.01 80.82,41.59 C15.2 C17.2 77.56,41.47 76.96,40.88 71.25,40.88 70.41,41.72 C14.2 v68.2,43.16 | C20.2 70.61,47.61 70.36,47.86 v70.36,48.24 | 80.64,79.87 U7.5 | C32.1 v88.01,82.41 | 2.03,24.5 2.03,36.31 4.19,38.47 6.45,38.47 R24.2 | v70.36,75.42 70.99,74.79 C34.2 | v68.33,70.34 C28.2 | C9.2 | U2.8 35.82,33.01 43.69,40.88 56.39,40.88 57.91,39.35 57.91,38.1 SERIAL.1
  Top 0.61: U2.22 38.36,21.19 38.99,20.56 42.93,20.56 v46.23,17.26
  Top 0.813: BATT.1 9.54,84.81 12.19,82.15 | 12.19,82.15 12.19,73.52 Q3.1 | 12.19,82.15 12.19,83.18 USBPWR.2 15.97,88.11 17.9,90.03 25.27,90.03 | R21.1 R19.1 21.87,58.94 21.21,58.28 19.05,58.28 17.65,56.88 17.65,54.85 16.32,53.51 11.49,53.51 | R24.2 7.72,38.44 8.89,39.61 8.89,45.83 10.44,47.38 R22.2 v11.18,53.2 11.49,53.51 | SJ3.1 11.49,53.51 | 25.27,90.03 C11.2 C12.2 27.18,81.77 | 27.18,81.77 C10.2 C13.2 | U3.1 45.24,87.84 45.97,87.11 v45.97,82.28 45.97,80.27 U4.1 | 25.27,90.03 31.52,90.03 LED1.C | 27.18,81.77 31.14,81.77 LED2.C 33.78,79.36 35.43,81.01 v37.97,81.01
  Bottom 0.305: v88.01,82.41 86.87,81.26 v79.25,81.26 79.25,80.25 79.76,79.74 SJ6.1
  Bottom 0.406: v70.36,48.24 78.36,48.24 79.76,49.64 SJ1.1 v79.76,52.82 | 91.19,78.09 91.19,69.83 90.04,68.69 v87,68.69
  Bottom 0.508: U2.22 38.23,23.93 38.23,26.53 35.81,28.94 U2.8 | v60.2,3.54 U$1.J1.6 | U$1.J1.6 88.17,7.89 90.71,10.43 U$1.J2.4 | 60.17,7.86 U$1.J1.6 | v88.14,55.23 90.04,57.13 JP5.1 92.71,57.13 91.31,55.74 91.31,50.15 | JP5.4 91.95,49.51 91.31,50.15 | 91.31,50.15 91.31,41.64 90.68,41.01 v87,41.01 | v70.36,48.24 68.2,46.09 | 68.2,46.09 v68.2,43.16 | 68.2,46.09 68.2,55.74 66.8,57.13 J2.5 62.99,57.13 61.47,58.66 61.47,82.28 | JP9.1 91.69,84.31 91.19,83.8 91.19,82.41 | 91.19,82.41 91.19,78.09 91.19,77.58 92.08,76.69 JP9.4 | v88.01,82.41 91.19,82.41 | BATT.1 9.54,88.37 8.76,89.14 3.43,89.14 1.79,87.5 1.79,58.52 7.11,53.2 v11.18,53.2 | v68.33,70.34 68.33,73.39 v70.36,75.42 70.36,82.66 68.71,84.31 J4.5 62.61,84.31 61.47,83.17 61.47,82.28 | v45.97,82.28 61.47,82.28
  Bottom 0.61: v46.23,17.26 48.39,15.1 53.34,15.1 57.78,10.65 57.78,9 58.9,7.89 U$1.J1.6
  Bottom 0.813: v37.97,81.01 44.7,81.01 v45.97,82.28
  pour Bottom (isolate 1.016): 63,39 91,39 96,44 96,85 91,90 65,90 63,88
  pour Top (isolate 1.016): 63,39 91,39 96,44 96,85 91,90 65,90 63,88
  pour Top (isolate 1.016): 6,94 0,88 0,4 4,0 88,0 98,10 98,37 54,37 42,49 42,63 43,64 45,64 53,72 53,94
  pour Bottom (isolate 1.016): 6,94 0,88 0,4 4,0 88,0 98,10 98,37 54,37 42,49 42,63 43,64 45,64 53,72 53,94
MISO
  Top 0.508: LCDSPI.4 45.09,12.53 PROG.4
  Bottom 0.508: 42.8,17.51 45.11,15.2 PROG.4
  Bottom 0.61: U2.18 28.2,21.06 31.75,17.51 42.8,17.51
MOSI
  Top 0.508: LCDSPI.3 42.55,12.53 PROG.3
  Bottom 0.508: 41.47,16.18 42.57,15.07 PROG.3
  Bottom 0.61: U2.17 25.66,21.06 30.54,16.18 41.47,16.18
N$8
  Top 0.508: U2.9 33.28,36.26 Y1.2 36.7,39.68 C9.1
N$9
  Top 0.508: U2.10 30.74,36.23 Y1.1 27.31,39.66 C8.1
N$11  (via drill 0.35)
  Top 0.813: R11.1 Q3.3 | AOD403.1 17.47,67.86 v17.53,67.8
  Bottom 0.813: v17.53,67.8 17.02,67.29 6.1,67.29 5.08,68.31 5.08,71.23 6.35,72.5 8.64,72.5 Q3.3
N$16
  Top 0.254: Q2.1 83.49,47.61 83.31,47.79 83.31,48.75 83.19,48.88 U5.2
N$17
  Top 0.813: D2.C R17.1
N$18
  Top 0.813: LED1.A 36.8,84.51 R7.1
N$19  (via drill 0.35)
  Top 0.406: R8.1 v38.61,75.8 | v38.61,79.36 LED2.A
  Bottom 0.406: v38.61,75.8 v38.61,79.36
N$20
  Top 0.254: R14.2 83.72,53.32 83.44,53.04 83.44,52.31 | 83.44,52.31 83.44,51.7 83.16,51.42 U5.4 | R15.1 86.45,52.04 86.18,52.31 83.44,52.31
N$21
  Top 0.508: R10.1 29.18,10.73 LED3.A
N$23
  Top 0.254: C18.2 83.9,55.23 83.44,54.77 83.44,54.42 82.98,53.96 U5.6
N$25
  Top 0.254: L2.2 84.7,48.76 84.96,48.5 86.34,48.5 86.7,48.14 Q2.3
  Top 0.508: L2.2 84.7,50.53 | 84.7,50.53 84.7,51.42 R15.2 | U5.3 83.26,50.15 83.64,50.53 84.7,50.53
N$26  (via drill 0.51)
  Top 0.254: U5.15 75.21,48.88 74.93,49.16 74.93,49.51 | R16.1 74.93,49.51 | v74.93,50.78 74.93,49.51
  Bottom 0.254: SJ1.2 v74.93,50.78
N$27
  Top 0.254: C16.1 78.4,56.19 79.36,55.23 U5.7 82.9,55.23 83.44,55.77 83.44,56.68 83.9,57.13 R12.2
N$28
  Top 0.254: R13.2 83.06,59.04 82.05,59.04 | 82.05,59.04 C16.2 | U5.8 82.05,59.04
N$29
  Top 0.813: SJ3.2 15.39,55.89 R18.1 R19.2
N$30
  Top 0.813: R20.1 D1.A
N$31
  Top 0.813: Q3.2 14.99,65.77 20.19,65.77 D1.C R17.2 28.22,60.64 R21.2
N$33
  Top 0.508: R27.1 22.38,13.09 21.72,12.43 20.93,12.43 R26.2 17.75,9.26 16.38,9.26 13.68,6.55 BUTTONPCB.4
N$34
  Top 0.508: R27.2 19.53,13.29 18.92,12.68 17.91,12.68 16.54,11.31 R28.1 16.54,10.93 15.11,9.51 13.97,9.51 11.14,6.68 BUTTONPCB.3
N$35
  Top 0.508: R29.1 16.54,13.34 16,12.81 14.48,12.81 13.69,12.02 R28.2 13.08,11.03 8.6,6.55 BUTTONPCB.2
N$36
  Top 0.508: BUTTONPCB.5 16.26,5.06 16.26,6.33 19.3,9.38 21.21,9.38 22.38,10.55 R26.1
N$114
  Top 0.254: Q5.1 83.49,74.78 83.31,74.97 83.31,75.93 83.19,76.06 U7.2
N$115
  Top 0.254: R38.2 83.72,80.5 83.44,80.22 83.44,79.49 | 83.44,79.49 83.44,78.88 83.16,78.6 U7.4 | R39.1 86.45,79.22 86.18,79.49 83.44,79.49
N$116
  Top 0.254: C32.2 83.9,82.41 83.44,81.95 83.44,81.59 82.98,81.14 U7.6
N$117
  Top 0.254: L4.2 84.7,75.94 84.96,75.68 86.34,75.68 86.7,75.31 Q5.3
  Top 0.508: L4.2 84.7,77.71 | 84.7,77.71 84.7,78.6 R39.2 | U7.3 83.26,77.33 83.64,77.71 84.7,77.71
N$118  (via drill 0.51)
  Top 0.254: U7.15 75.21,76.06 74.93,76.34 74.93,76.69 | R40.1 74.93,76.69 | v74.93,77.96 74.93,76.69
  Bottom 0.254: SJ6.2 v74.93,77.96
N$119
  Top 0.254: C30.1 78.4,83.37 79.36,82.41 U7.7 82.9,82.41 83.44,82.95 83.44,83.85 83.9,84.31 R36.2
N$120
  Top 0.254: R37.2 83.06,86.22 82.05,86.22 | 82.05,86.22 C30.2 | U7.8 82.05,86.22
ONSWT
  Top 0.813: ONSWT.1 R18.2 R20.2
PWR  (via drill 0.35)
  Top 0.813: U3.3 40.62,87.84 39.88,87.11 39.88,80.27 U4.3 38.79,77.71 32,77.71 v31.88,77.83 30.23,79.49 C10.1 | C11.1 30.35,88.12 v31.88,86.6 | AOD403.4 19.75,79.04 v23.24,82.53
  Bottom 0.813: v31.88,86.6 31.88,82.41 | 31.88,82.41 v31.88,77.83 | v23.24,82.53 31.75,82.53 31.88,82.41
PWRADC  (via drill 0.35)
  Top 0.406: v29.46,21.19 18.29,21.19 v15.49,23.99 | v15.49,26.02 v15.49,31.48 | v15.62,41.26 11.2,41.26 R23.2
  Top 0.813: R22.1 R23.2
  Bottom 0.406: U2.26 45.91,21.19 v29.46,21.19 | v15.49,23.99 v15.49,26.02 | v15.49,31.48 17.78,31.48 18.03,31.73 18.03,38.85 v15.62,41.26
PWRCHK  (via drill 0.35)
  Top 0.508: SJ4.2 D3.A | v14.61,38.47 14.58,38.44 R23.1
  Top 0.813: v29.59,71.99 29.85,71.73 D3.A
  Bottom 0.508: 24.32,74.22 24.32,58.4 14.22,48.31 14.22,38.85 v14.61,38.47
  Bottom 0.813: USBPWR.1 19.47,79.06 24.32,74.22 26.54,71.99 v29.59,71.99
PWRLATCH  (via drill 0.35)
  Top 0.508: v32.26,57.39 32.64,57.77 D2.A
  Bottom 0.508: U2.12 25.66,33.26 26.16,33.77 30.1,33.77 32.26,35.92 v32.26,57.39
RST
  Top 0.508: PROG.6 50.17,12.53 LCDSPI.6 50.19,5.32 60.96,5.32 79.76,24.11 79.76,34.4 78.63,35.52 SW1.A SW1.A' 69.24,36.2 64.52,36.2 R6.1 59.74,31.42 U2.1
RX
  Top 0.508: U2.2 55.27,35.64 SERIAL.2
SCK
  Top 0.508: LCDSPI.2 40.01,12.53 | 40.01,12.53 PROG.2 | 40.01,15.22 40.01,12.53 | R10.2 34.16,13.32 36.07,15.22 40.01,15.22 | 40.01,15.73 40.01,15.22 | 38.61,19.54 40.01,18.14 40.01,18.02
  Top 0.61: U2.19 30.73,21.07 32.26,19.54 38.61,19.54 | 40.01,18.02 40.01,15.73
SCKHX  (via drill 0.35)
  Top 0.254: U5.11 74.8,53.96 74.17,53.32 66.55,53.32 J2.4
  Top 0.508: v35.69,54.59 v58.8,54.59
  Bottom 0.508: U2.14 20.58,51.04 29.34,59.8 34.54,59.8 35.69,58.66 v35.69,54.59 | v58.8,54.59 J2.4
SCKHX2  (via drill 0.35)
  Top 0.254: U7.11 74.8,81.14 74.17,80.5 66.55,80.5 J4.4
  Top 0.406: v18.16,25.91 18.16,31.73 v19.05,32.62 | v35.69,61.2 40.51,66.02 43.94,66.02 50.67,72.75 v50.67,74.91 | v60.07,81.14 62.23,81.14 62.87,81.77 J4.4
  Bottom 0.406: U2.15 20.5,23.73 18.41,23.73 18.16,23.99 v18.16,25.91 | v19.05,32.62 19.05,51.16 29.08,61.2 v35.69,61.2 | v50.67,74.91 50.67,79.36 52.58,81.26 59.94,81.26 v60.07,81.14
SCL
  Top 0.508: U2.28 53.6,19.79 57.88,15.51 U$1.J1.3
  Bottom 0.508: U$1.J1.3 87.41,15.51 89.95,18.05 U$1.J2.1
SDA
  Top 0.508: U2.27 51.06,19.67 57.78,12.94 60.17,12.94 U$1.J1.4
  Bottom 0.508: U$1.J1.4 87.66,12.97 90.2,15.51 U$1.J2.2
SS
  Top 0.508: LCDSPI.5 47.63,12.53 PROG.5
  Bottom 0.508: 35.66,15.07 35.94,14.79 35.94,9.64 37.85,7.73 46.61,7.73 47.63,6.71 LCDSPI.5
  Bottom 0.61: U2.16 23.12,21.06 29.11,15.07 35.66,15.07
STAT  (via drill 0.35)
  Top 0.508: v52.2,9.64 v52.2,16.37
  Bottom 0.508: STATLED.2 32.62,2.27 50.93,2.27 52.2,3.54 v52.2,9.64 | v52.2,16.37 56.01,20.18 56.01,28.05 54.48,29.57 45.21,29.57 43.44,31.35 U2.5
TEMP
  Top 0.508: R9.1 6.73,29.57 DSB.2 4.06,29.57 3.81,29.57 | 20.9,33.64 U2.13
  Top 0.61: 3.81,29.57 3.81,33.13 4.32,33.64 20.9,33.64 | 4.06,29.57 6.73,29.57
TX
  Top 0.508: U2.3 52.73,35.64 SERIAL.3

### Text on the board
Bottom: v11 | v11
tPlace: Load Cell Amp | GND | YLW | CLK | GRN | DAT | WHT | VCC | BLK | VDD | RED | Load Cell Amp | GND | YLW | Open Coffee Scale V2 / Designed by Tirta Inovan / CC BY-SA | CLK | GRN | DAT | WHT | VCC | BLK | VDD | RED
bPlace: Load Cell Amp | GND | B- | YLW/SD | CLK | B+ | GRN/A+ | RATE | DAT | WHT/A- | 2.7-5V | BLK/E- | 2.7-5V | RED/E+ | Load Cell Amp | GND | B- | YLW/SD | Open Coffee Scale V2 / Designed by Tirta Inovan / CC BY-SA | CLK | B+ | GRN/A+ | DAT | RATE | WHT/A- | 2.7-5V | BLK/E- | 2.7-5V | RED/E+
Measures: Units are in inches | Units are in inches